# Altium schematic sheet USB-PC.SchDoc
size A4
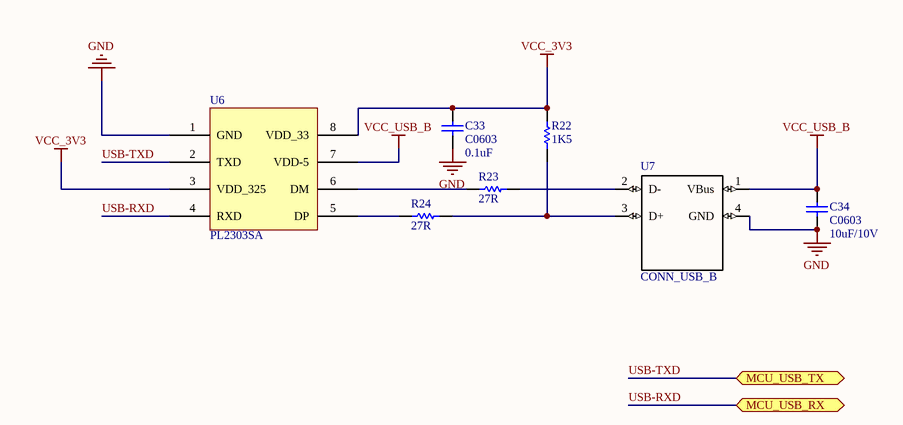
[diagram p0: USB-PC.SchDoc]

## Parts
C33  C0603  value 0.1uF  [C0603]
C34  C0603  value 10uF/10V  [C0603]
R22  value 1K5  [CC1608-0603]  (hidden comment: Res0603)
R23  value 27R  [CC1608-0603]  (hidden comment: Res0603)
R24  value 27R  [CC1608-0603]  (hidden comment: Res0603)
U6  PL2303SA  [PL2302SA]
U7  CONN_USB_B  [CONN_USB_B]

## Ports
MCU_USB_RX, MCU_USB_TX

## Nets
GND: C33.1 C34.1 U6.1(GND) U7.4(GND)
VCC_3V3: C33.2 R22.2 U6.3(VDD_325) U6.8(VDD_33)
VCC_USB_B: C34.2 U6.7(VDD-5) U7.1(VBus)
USB-RXD: U6.4(RXD) ; port MCU_USB_RX
USB-TXD: U6.2(TXD) ; port MCU_USB_TX
NetR22_1: R22.1 R24.1 U7.3(D+)
NetR23_1: R23.1 U7.2(D-)
NetR23_2: R23.2 U6.6(DM)
NetR24_2: R24.2 U6.5(DP)

## Library data of the parts
C33 C34 = C0603: Ceramic Chip Capacitor - Standard; Note: Footprint corresponds to dimensions for bulk cassette packaging. This case size has tightened tolerances.; Published: 17-Jul-2002; LatestRevisionDate: 19-Mar-2004; LatestRevisionNote: Silkscreen size reduced.; DatasheetDocument: Mar-2001; PackageDocument: Mar-2001; PackageReference: 0603; Publisher: Altium Limited; Code_JEITA: 0603; Code_IPC: 1608 [0603]; ComponentLink1Description: Manufacturer Link; ComponentLink1URL: http://www.kemet.com/; ComponentLink2Description: Datasheet; ComponentLink2URL: http://www.kemet.com/kemet/web/homepage/kechome.nsf/vapubfilesname/F3102TA.pdf/$file/F3102TA.pdf
R22-R24 = Res0603: Resistor; Manufacturer: Generic Components; Class I: Passive; Published: 8-Jun-2000; Revision: July-2002: Re-released for DXP Platform.; Publisher: Altium Limited; Class II: Resistor